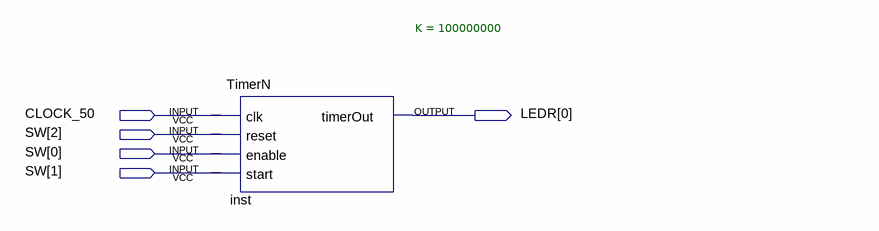
[diagram p0: schematic sheet]
// Quartus schematic TimerN_Demo.bdf as structural Verilog: 1 symbols, 5 pins
module TimerN_Demo (
  input  CLOCK_50,
  input  [2:0] SW,
  output [0:0] LEDR
);

  TimerN #(.K(100000000)) inst (.clk(CLOCK_50), .reset(SW[2]), .enable(SW[0]), .start(SW[1]), .timerOut(LEDR[0]));
endmodule
